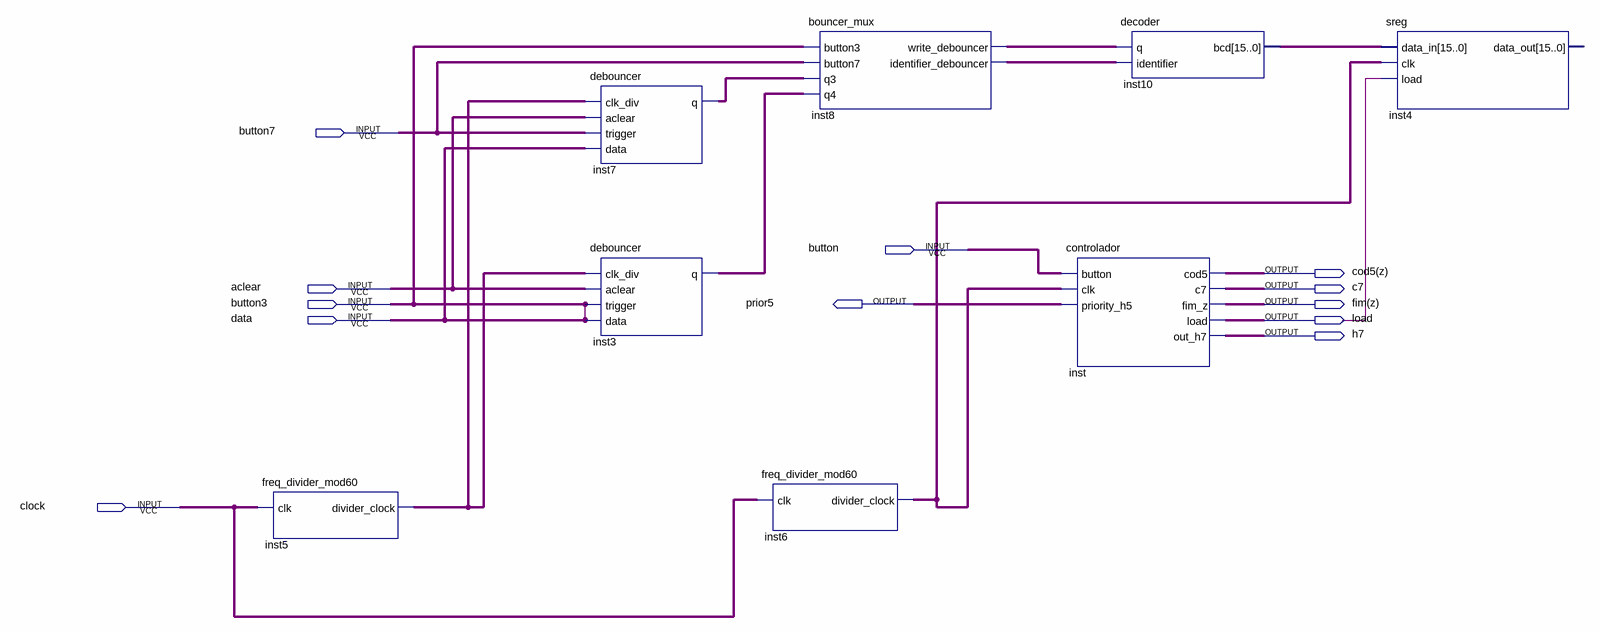
[diagram p0: schematic sheet]
// Quartus schematic h7_v1.bdf as structural Verilog: 8 symbols, 12 pins
module h7_v1 (
  input  button7,
  input  button,
  input  aclear,
  input  button3,
  input  data,
  input  clock,
  output \cod5(z) ,
  output c7,
  output prior5,
  output \fim(z) ,
  output load,
  output h7
);

  wire inst3_q, inst5_divider_clock, inst6_divider_clock, inst7_q, inst8_identifier_debouncer,
       inst8_write_debouncer, undriven;
  wire [15:0] inst10_bcd;

  freq_divider_mod60 inst5 (.clk(clock), .divider_clock(inst5_divider_clock));
  debouncer inst7 (.clk_div(inst5_divider_clock), .aclear(aclear), .trigger(button7), .data(button3), .q(inst7_q));
  debouncer inst3 (.clk_div(inst5_divider_clock), .aclear(aclear), .trigger(button3), .data(button3), .q(inst3_q));
  freq_divider_mod60 inst6 (.clk(clock), .divider_clock(inst6_divider_clock));
  bouncer_mux inst8 (
    .button3(button3), .button7(button7), .q3(inst7_q), .q4(inst3_q),
    .write_debouncer(inst8_write_debouncer), .identifier_debouncer(inst8_identifier_debouncer));
  controlador inst (
    .button(button), .clk(inst6_divider_clock), .priority_h5(prior5), .cod5(\cod5(z) ), .c7(c7),
    .fim_z(\fim(z) ), .load(load), .out_h7(h7));
  decoder inst10 (.q(inst8_write_debouncer), .identifier(inst8_identifier_debouncer), .bcd(inst10_bcd));
  sreg inst4 (.data_in(inst10_bcd), .clk(inst6_divider_clock), .load(undriven));  // open: data_out

  assign data = button3;
endmodule
